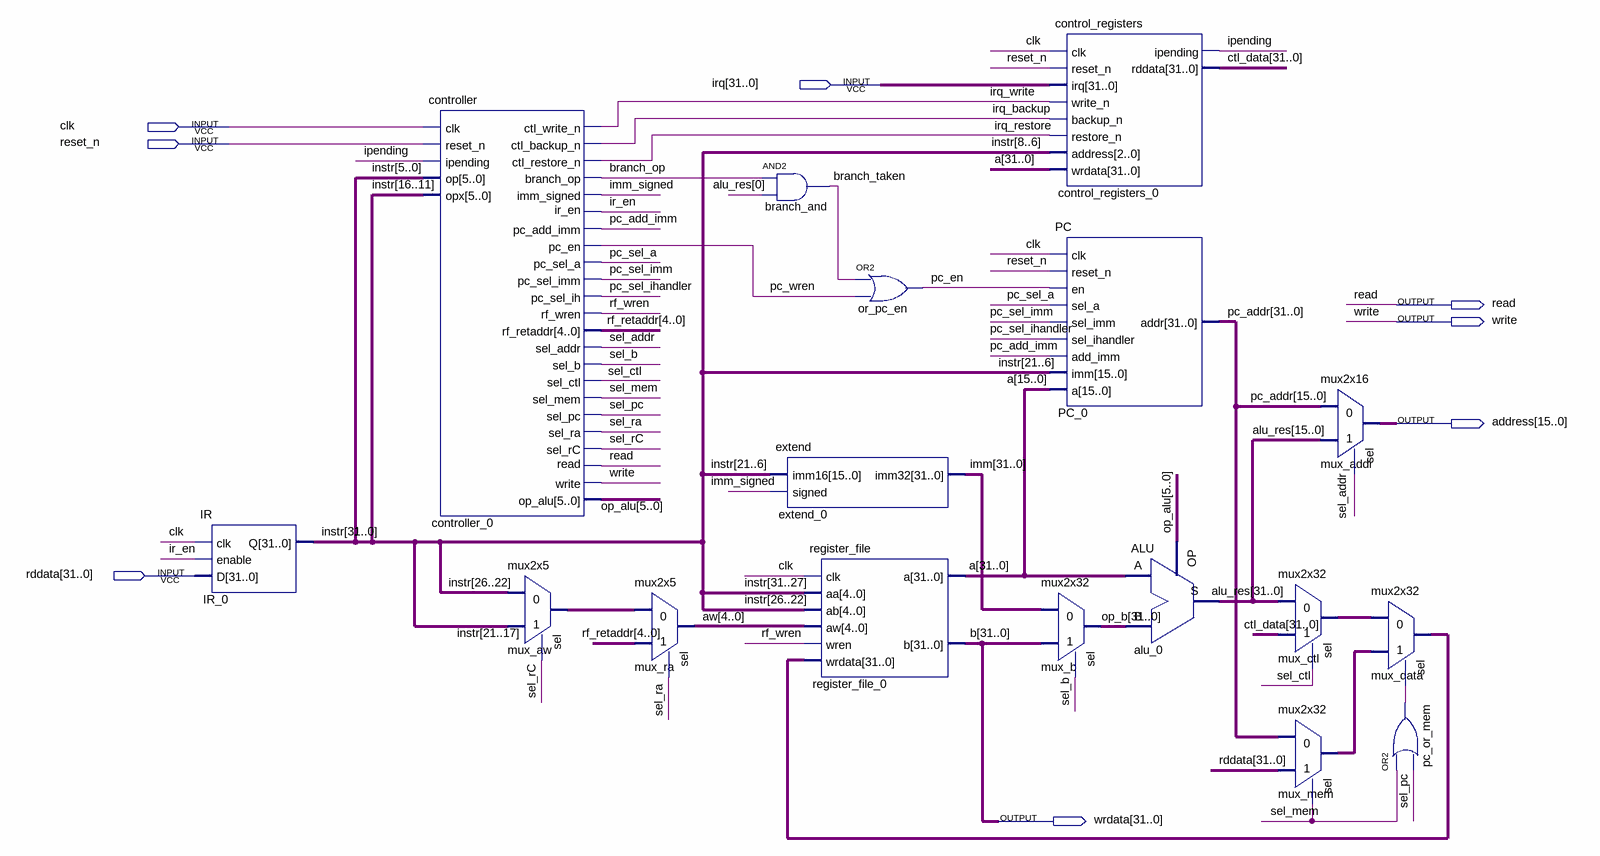
[diagram p0: schematic sheet]
// Quartus schematic CPU.bdf as structural Verilog: 17 symbols, 8 pins
module CPU (
  input  [31:0] irq,
  input  clk,
  input  reset_n,
  input  [31:0] rddata,
  output read,
  output write,
  output [15:0] address,
  output [31:0] wrdata
);

  wire branch_op, branch_taken, imm_signed, ipending, ir_en, irq_backup, irq_restore, irq_write, pc_add_imm,
       pc_en, pc_or_mem_out, pc_sel_a, pc_sel_ihandler, pc_sel_imm, pc_wren, rf_wren, sel_addr, sel_b,
       sel_ctl, sel_mem, sel_pc, sel_ra, sel_rC;
  wire [4:0] aw, mux_aw_o, rf_retaddr;
  wire [5:0] op_alu;
  wire [31:0] a, alu_res, ctl_data, imm, instr, mux_ctl_o, mux_data_o, mux_mem_o, op_b, pc_addr;

  IR IR_0 (.clk(clk), .enable(ir_en), .D(rddata), .Q(instr));
  controller controller_0 (
    .clk(clk), .reset_n(reset_n), .ipending(ipending), .op(instr[5:0]), .opx(instr[16:11]),
    .branch_op(branch_op), .imm_signed(imm_signed), .ir_en(ir_en), .pc_add_imm(pc_add_imm), .pc_en(pc_wren),
    .pc_sel_a(pc_sel_a), .pc_sel_imm(pc_sel_imm), .rf_wren(rf_wren), .sel_addr(sel_addr), .sel_b(sel_b),
    .sel_mem(sel_mem), .sel_pc(sel_pc), .sel_ra(sel_ra), .sel_rC(sel_rC), .write(write), .op_alu(op_alu),
    .pc_sel_ih(pc_sel_ihandler), .rf_retaddr(rf_retaddr), .ctl_backup_n(irq_backup),
    .ctl_restore_n(irq_restore), .ctl_write_n(irq_write), .sel_ctl(sel_ctl), .read(read));
  mux2x5 mux_aw (.i0(instr[26:22]), .i1(instr[21:17]), .sel(sel_rC), .o(mux_aw_o));
  mux2x5 mux_ra (.i0(mux_aw_o), .i1(rf_retaddr), .sel(sel_ra), .o(aw));
  and branch_and (branch_taken, branch_op, alu_res[0]);
  extend extend_0 (.imm16(instr[21:6]), .\signed (imm_signed), .imm32(imm));
  register_file register_file_0 (
    .clk(clk), .aa(instr[31:27]), .ab(instr[26:22]), .aw(aw), .wren(rf_wren), .wrdata(mux_data_o), .a(a),
    .b(wrdata));
  or or_pc_en (pc_en, branch_taken, pc_wren);
  mux2x32 mux_b (.i0(imm), .i1(wrdata), .sel(sel_b), .o(op_b));
  control_registers control_registers_0 (
    .clk(clk), .reset_n(reset_n), .irq(irq), .write_n(irq_write), .backup_n(irq_backup),
    .restore_n(irq_restore), .address(instr[8:6]), .wrdata(a), .ipending(ipending), .rddata(ctl_data));
  PC PC_0 (
    .clk(clk), .reset_n(reset_n), .en(pc_en), .sel_a(pc_sel_a), .sel_imm(pc_sel_imm), .add_imm(pc_add_imm),
    .imm(instr[21:6]), .a(a[15:0]), .sel_ihandler(pc_sel_ihandler), .addr(pc_addr));
  ALU alu_0 (.a(a), .b(op_b), .op(op_alu), .s(alu_res));
  mux2x32 mux_ctl (.i0(alu_res), .i1(ctl_data), .sel(sel_ctl), .o(mux_ctl_o));
  mux2x32 mux_mem (.i0(pc_addr), .i1(rddata), .sel(sel_mem), .o(mux_mem_o));
  mux2x16 mux_addr (.i0(pc_addr[15:0]), .i1(alu_res[15:0]), .sel(sel_addr), .o(address));
  mux2x32 mux_data (.i0(mux_ctl_o), .i1(mux_mem_o), .sel(pc_or_mem_out), .o(mux_data_o));
  or pc_or_mem (pc_or_mem_out, sel_mem, sel_pc);

  // Other names for the same wires on the sheet: b[31:0] = wrdata
endmodule
